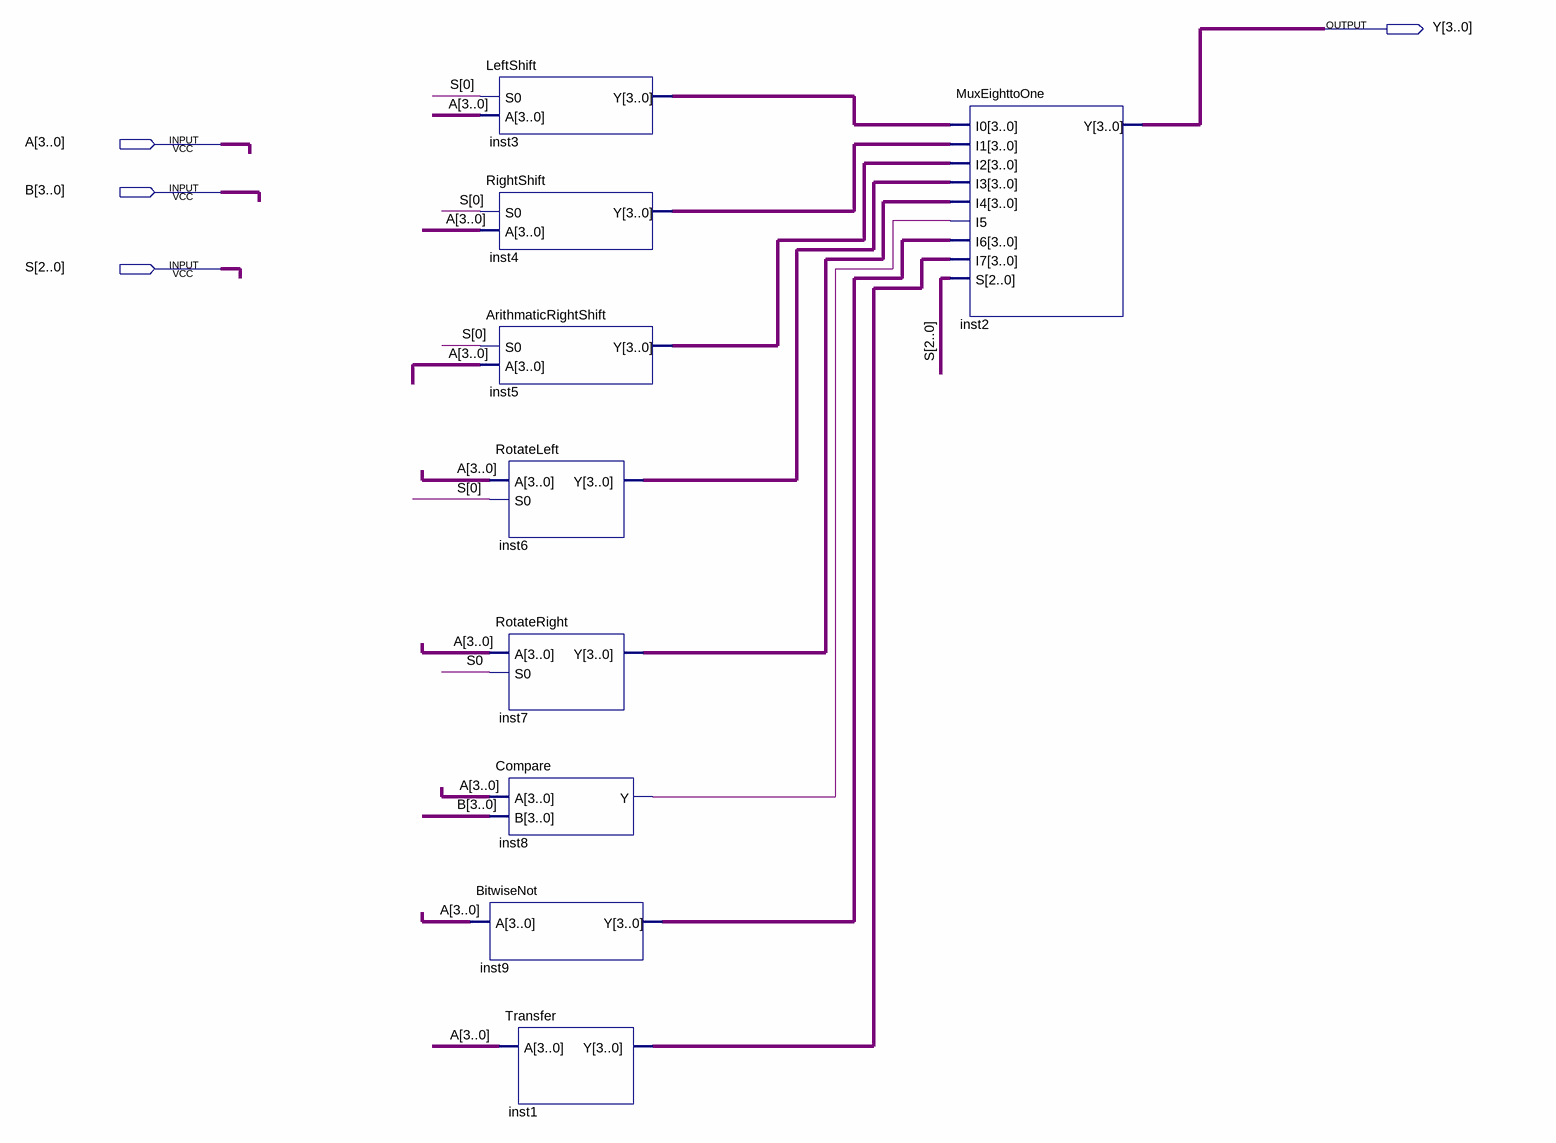
[diagram p0: schematic sheet]
// Quartus schematic LogicalUnitMain.bdf as structural Verilog: 9 symbols, 4 pins
module LogicalUnitMain (
  input  [3:0] A,
  input  [3:0] B,
  input  [2:0] S,
  output [3:0] Y
);

  wire inst8_y;
  wire [3:0] inst1_y, inst3_y, inst4_y, inst5_y, inst6_y, inst7_y, inst9_y;

  LeftShift inst3 (.S0(S[0]), .A(A), .Y(inst3_y));
  RightShift inst4 (.S0(S[0]), .A(A), .Y(inst4_y));
  ArithmaticRightShift inst5 (.S0(S[0]), .A(A), .Y(inst5_y));
  RotateLeft inst6 (.A(A), .S0(S[0]), .Y(inst6_y));
  RotateRight inst7 (.A(A), .S0(S[0]), .Y(inst7_y));
  Compare inst8 (.A(A), .B(B), .Y(inst8_y));
  BitwiseNot inst9 (.A(A), .Y(inst9_y));
  Transfer inst1 (.A(A), .Y(inst1_y));
  MuxEighttoOne inst2 (
    .I0(inst3_y), .I1(inst4_y), .I2(inst5_y), .I3(inst6_y), .I4(inst7_y), .I5(inst8_y), .I6(inst9_y),
    .I7(inst1_y), .S(S), .Y(Y));
endmodule
